# Altium schematic sheet 1 040 1573.rev01.SchDoc
size A4; SheetNumber: 1; SheetTotal: 5
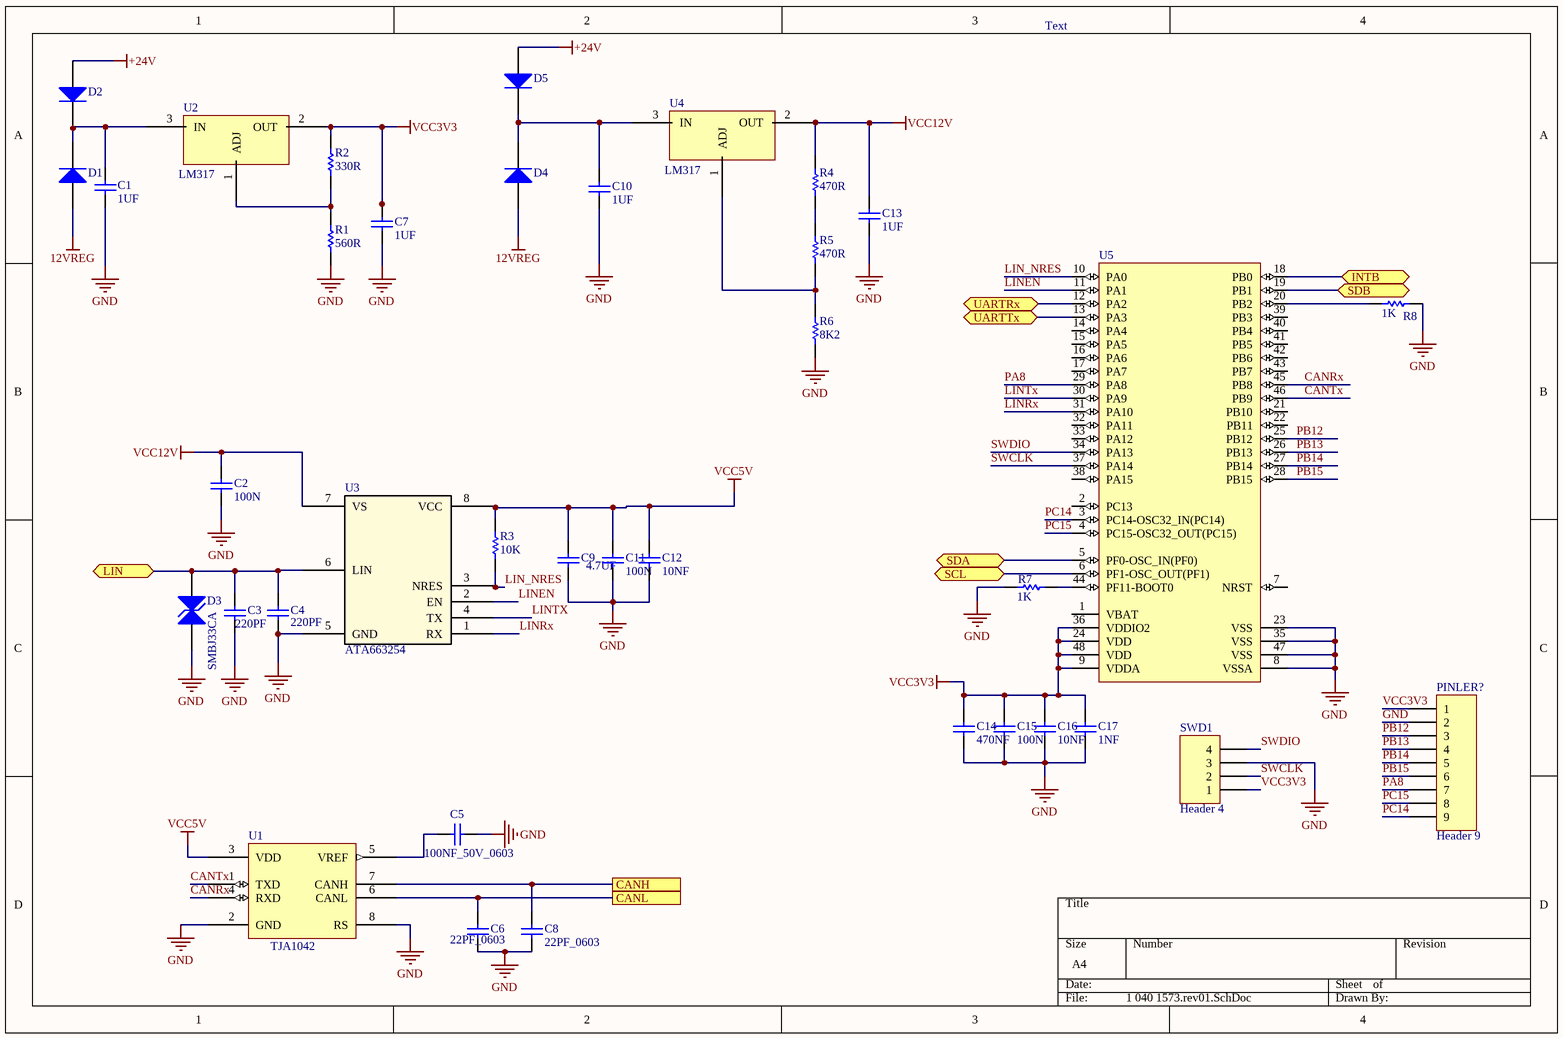
[diagram p0: 1 040 1573.rev01.SchDoc]

## Parts
C1  1UF  [Capacitor(0603)-1]
C2  100N  [Capacitor(0603)-1]
C3  220PF  [Capacitor(0805)-1]
C4  220PF  [Capacitor(0805)-1]
C5  100NF_50V_0603  [Capacitor(0603)-1]
C6  22PF_0603  [Capacitor(0603)-1]
C7  1UF  [Capacitor(0603)-1]
C8  22PF_0603  [Capacitor(0603)-1]
C9  4.7UF  [Capacitor(0805)-1]
C10  1UF  [Capacitor(0603)-1]
C11  100N  [Capacitor(0603)-1]
C12  10NF  [Capacitor(0603)-1]
C13  1UF  [Capacitor(0603)-1]
C14  470NF  [Capacitor(0603)-1]
C15  100N  [Capacitor(0603)-1]
C16  10NF  [Capacitor(0603)-1]
C17  1NF  [Capacitor(0603)-1]
D1  DIODE_1000V_2A_DO214AC_S2M  [DIODE M7_DO214AC]  (value not drawn)
D2  DIODE_1000V_2A_DO214AC_S2M  [DIODE M7_DO214AC]  (value not drawn)
D3  SMBJ33CA  [SMBJ]
D4  DIODE_1000V_2A_DO214AC_S2M  [DIODE M7_DO214AC]  (value not drawn)
D5  DIODE_1000V_2A_DO214AC_S2M  [DIODE M7_DO214AC]  (value not drawn)
PINLER?  Header 9  [HDR1X9]
R1  560R  [Resistor(0805) -1]
R2  330R  [Resistor(0805) -1]
R3  10K  [Resistor(0603) -1]
R4  470R  [Resistor(0603) -1]
R5  470R  [Resistor(0603) -1]
R6  8K2  [Resistor(0603) -1]
R7  1K  [Resistor(0603) -1]
R8  1K  [Resistor(0603) -1]
SWD1  Header 4  [HDR1X4]
U1  TJA1042  [SO-8]
U2  LM317  [DPAK]
U3  ATA663254  [SO-8]
U4  LM317  [DPAK]
U5  IC_MCU_SMD_LQFP48_ST_STM32F042C6T6  [LQFP48]  (value not drawn)

## Ports
CANH (see 1 040 1573.rev01_highside[4B]), CANL (see 1 040 1573.rev01_highside[4B]), INTB (bidir, see 1 040 1573.rev01_driver[2B]), LIN (bidir, see 1 040 1573.rev01_highside[4B]), SCL (bidir, see 1 040 1573.rev01_driver[2B]), SDA (bidir, see 1 040 1573.rev01_driver[2B]), SDB (bidir, see 1 040 1573.rev01_driver[2B]), UARTRx (bidir, see 1 040 1573.rev01_uart[3B]), UARTTx (bidir, see 1 040 1573.rev01_uart[3B])

## Nets
12VREG: D1.1(A) D4.1(A)
+24V: D2.1(A) D5.1(A)
GND: C1.1 C2.1 C3.1 C4.1 C5.2 C6.1 C7.1 C8.1 C9.1 C10.1 C11.1 C12.1 C13.1 C14.1 C15.1 C16.1 C17.1 D3.1(A) PINLER?.2 R1.1 R6.1 R7.1 R8.2 SWD1.3 U1.2(GND) U1.8(RS) U3.5(GND) U5.8(VSSA) U5.23(VSS) U5.35(VSS) U5.47(VSS)
VCC3V3: C7.2 C14.2 C15.2 C16.2 C17.2 PINLER?.1 R2.1 SWD1.1 U2.2(OUT) U5.9(VDDA) U5.24(VDD) U5.36(VDDIO2) U5.48(VDD)
VCC5V: C9.2 C11.2 C12.2 R3.2 U1.3(VDD) U3.8(VCC)
VCC12V: C2.2 C13.2 R4.2 U3.7(VS) U4.2(OUT)
CANH: C8.2 U1.7(CANH) ; port CANH
CANL: C6.2 U1.6(CANL) ; port CANL
CANRx: U1.4(RXD) U5.45(PB8)
CANTx: U1.1(TXD) U5.46(PB9)
INTB: U5.18(PB0) ; port INTB
LIN: C3.2 C4.2 D3.2(K) U3.6(LIN) ; port LIN
LIN_NRES: R3.1 U3.3(NRES) U5.10(PA0)
LINEN: U3.2(EN) U5.11(PA1)
LINRx: U3.1(RX) U5.31(PA10)
LINTx: U3.4(TX) U5.30(PA9)
PA8: PINLER?.7 U5.29(PA8)
PB12: PINLER?.3 U5.25(PB12)
PB13: PINLER?.4 U5.26(PB13)
PB14: PINLER?.5 U5.27(PB14)
PB15: PINLER?.6 U5.28(PB15)
PC14: PINLER?.9 U5.3(PC14-OSC32_IN(PC14))
PC15: PINLER?.8 U5.4(PC15-OSC32_OUT(PC15))
SCL: U5.6(PF1-OSC_OUT(PF1)) ; port SCL
SDA: U5.5(PF0-OSC_IN(PF0)) ; port SDA
SDB: U5.19(PB1) ; port SDB
SWCLK: SWD1.2 U5.37(PA14)
SWDIO: SWD1.4 U5.34(PA13)
UARTRx: U5.12(PA2) ; port UARTRx
UARTTx: U5.13(PA3) ; port UARTTx
NetC1_2: C1.2 D1.2(K) D2.2(K) U2.3(IN)
NetC5_1: C5.1 U1.5(VREF)
NetC10_2: C10.2 D4.2(K) D5.2(K) U4.3(IN)
NetR1_2: R1.2 R2.2 U2.1(ADJ)
NetR4_1: R4.1 R5.2
NetR5_1: R5.1 R6.2 U4.1(ADJ)
NetR7_2: R7.2 U5.44(PF11-BOOT0)
NetR8_1: R8.1 U5.20(PB2)

Not connected (* = marked no-connect by the designer): U5 1(VBAT) 2(PC13) 7(NRST) 14(PA4) 15(PA5) 16(PA6) 17(PA7) 21(PB10) 22(PB11) 32(PA11) 33(PA12) 38(PA15) 39(PB3) 40(PB4) 41(PB5) 42(PB6) 43(PB7)

## Notes on the sheet
- Text

## Library data of the parts
C1 C7 C10 C13 = CAP_CER_SMD_1UF_50V_0603_AEC: 1 043 0030; Published: 8-Jun-2000; LatestRevisionDate: 17-Jul-2002; LatestRevisionNote: Re-released for DXP Platform.; PackageReference: RAD-0.3; Publisher: Altium Limited; Stok Kodu: 1 043 0030
C2 C11 C15 = CAP_CER_SMD_100NF_50V_0603_AEC: 1 043 0098; Published: 8-Jun-2000; LatestRevisionDate: 17-Jul-2002; LatestRevisionNote: Re-released for DXP Platform.; PackageReference: RAD-0.3; Publisher: Altium Limited; Stok Kodu: 1 043 0098
C3 C4 = CAP_CER_SMD_220PF_50V_0805: 1 043 0179; Published: 8-Jun-2000; LatestRevisionDate: 17-Jul-2002; LatestRevisionNote: Re-released for DXP Platform.; PackageReference: RAD-0.3; Publisher: Altium Limited; Stok Kodu: 1 043 0179
C5 = CAP_CER_SMD_100NF_50V_0603: 1 043 0097; Published: 8-Jun-2000; LatestRevisionDate: 17-Jul-2002; LatestRevisionNote: Re-released for DXP Platform.; PackageReference: RAD-0.3; Publisher: Altium Limited; Stok Kodu: 1 043 0097
C6 C8 = CAP_CER_SMD_22PF_50V_%5_0603: 1 043 0235; Published: 8-Jun-2000; LatestRevisionDate: 17-Jul-2002; LatestRevisionNote: Re-released for DXP Platform.; PackageReference: RAD-0.3; Publisher: Altium Limited; Stok Kodu: 1 043 0235
C9 = CAP_CER_SMD_4.7UF_35V_0805: 1 043 0232; Published: 8-Jun-2000; LatestRevisionDate: 17-Jul-2002; LatestRevisionNote: Re-released for DXP Platform.; PackageReference: RAD-0.3; Publisher: Altium Limited; Stok Kodu: 1 043 0232
C12 C16 = CAP_CER_SMD_10NF_50V_0603_AEC: 1 043 0103; Published: 8-Jun-2000; LatestRevisionDate: 17-Jul-2002; LatestRevisionNote: Re-released for DXP Platform.; PackageReference: RAD-0.3; Publisher: Altium Limited; Stok Kodu: 1 043 0103
C14 = CAP_CER_SMD_470NF_50V_0603: 1 043 0128; Published: 8-Jun-2000; LatestRevisionDate: 17-Jul-2002; LatestRevisionNote: Re-released for DXP Platform.; PackageReference: RAD-0.3; Publisher: Altium Limited; Stok Kodu: 1 043 0128
C17 = CAP_CER_SMD_1NF_50V_0603: 1 043 0109; Published: 8-Jun-2000; LatestRevisionDate: 17-Jul-2002; LatestRevisionNote: Re-released for DXP Platform.; PackageReference: RAD-0.3; Publisher: Altium Limited; Stok Kodu: 1 043 0109
D1 D2 D4 D5 = DIODE_1000V_2A_DO214AC_S2M_VISHAY_SA2M-E3/5AT: 1 044 0078; Published: 8-Jun-2000; LatestRevisionDate: 17-Jul-2002; LatestRevisionNote: Re-released for DXP Platform.; DatasheetDocument: 1998; PackageDocument: Aug-1999; PackageReference: DO-41; Publisher: Altium Limited; Code_JEDEC: DO-214-AC; ComponentLink1Description: Manufacturer Link; ComponentLink1URL: http://www.fairchildsemi.com/; ComponentLink2Description: Datasheet; ComponentLink2URL: http://www.fairchildsemi.com/ds/1N%2F1N4001.pdf; Stok Kodu: 1 044 0078
D3 = DIODE_TVS_53.3V_11.3A_DO214AA_SMBJ33CA: 1 044 0085; Published: 24-Mar-1999; LatestRevisionDate: 17-Jul-2002; LatestRevisionNote: Re-released for DXP Platform.; PackageReference: DO-7; Publisher: Altium Limited; PackageDescription: Axial Lead Diode; Stok Kodu: 1 044 0085
PINLER? = Header 9: Header, 9-Pin; LatestRevisionDate: 17-Jul-2002; LatestRevisionNote: Re-released for DXP Platform.; Publisher: Altium Limited
R1 = RES_SMD_560R_%1_0805: 1 042 0502; Published: 8-Jun-2000; LatestRevisionDate: 17-Jul-2002; LatestRevisionNote: Re-released for DXP Platform.; PackageReference: AXIAL-0.3; Publisher: Altium Limited; Stok Kodu: 1 042 0502
R2 = RES_SMD_330R_%1_0805: 1 042 0617; Published: 8-Jun-2000; LatestRevisionDate: 17-Jul-2002; LatestRevisionNote: Re-released for DXP Platform.; PackageReference: AXIAL-0.3; Publisher: Altium Limited; Stok Kodu: 1 042 0617
R3 = RES_SMD_10K_%1_0603_AEC: 1 042 0276; Published: 8-Jun-2000; LatestRevisionDate: 17-Jul-2002; LatestRevisionNote: Re-released for DXP Platform.; PackageReference: AXIAL-0.3; Publisher: Altium Limited; Stok Kodu: 1 042 0276
R4 R5 = RES_SMD_470R_%1_0603: 1 042 0611; Published: 8-Jun-2000; LatestRevisionDate: 17-Jul-2002; LatestRevisionNote: Re-released for DXP Platform.; PackageReference: AXIAL-0.3; Publisher: Altium Limited; Stok Kodu: 1 042 0611
R6 = RES_SMD_8K2_%1_0603: 1 042 0610; Published: 8-Jun-2000; LatestRevisionDate: 17-Jul-2002; LatestRevisionNote: Re-released for DXP Platform.; PackageReference: AXIAL-0.3; Publisher: Altium Limited; Stok Kodu: 1 042 0610
R7 R8 = RES_SMD_1K_%1_0603_AEC: 1 042 0331; Published: 8-Jun-2000; LatestRevisionDate: 17-Jul-2002; LatestRevisionNote: Re-released for DXP Platform.; PackageReference: AXIAL-0.3; Publisher: Altium Limited; Stok Kodu: 1 042 0331
SWD1 = Header 4: Header, 4-Pin; LatestRevisionDate: 17-Jul-2002; LatestRevisionNote: Re-released for DXP Platform.; Publisher: Altium Limited
U1 = IC_TRANSCEIVER_SMD_SO8_NXPUSA_TJA1042: 1 046 0141; Manufacturer: NXP USA Inc.; Published: 6-Oct-2005; LatestRevisionDate: 13-Apr-2006; LatestRevisionNote: IPC-7351 Footprint Added.; DatasheetVersion: Nov-2003; PackageVersion: Oct-2005; PackageReference: SOIC150-8; Publisher: Altium Limited; PackageDescription: 8-Pin Plastic Narrow Body Small Outline Integrated Circuit 1.27 mm Pitch; Code_JEDEC: MS-012; ComponentLink1Description: Manufacturer Link; ComponentLink1URL: http://www.microchip.com; ComponentLink2Description: Datasheet; ComponentLink2URL: http://ww1.microchip.com/downloads/en/DeviceDoc/21667d.pdf; Stok Kodu: 1 046 0141; Manufacturer Product Number: TJA1042
U2 U4 = IC_REG_THT_TO220_LUMIMAX_LM317: 1 046 0079; Manufacturer: Lumimax Optoelectronic Technology; Stok Kodu: 1 046 0079; Manufacturer Product Number: LM317
U3 = ATA663254: 1 046 0259; Mfr_Name: Texas Instruments; RefDes: RefDes; Type: Type
U5 = IC_MCU_SMD_LQFP48_ST_STM32F042C6T6: 1 046 0212; Stok Kodu: 1 046 0212; Manufacturer Product Number: STM32F042C6T6; Manufacturer: Manufacturer